# EAGLE design LEDARRAYHI (EAGLE 8.6.0)
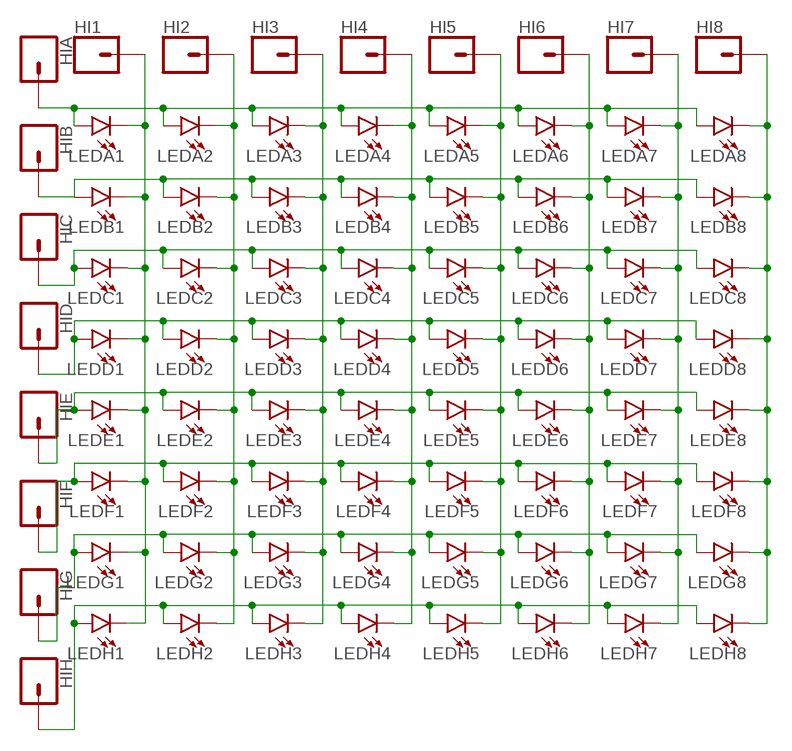
[diagram p0: schematic, sheet 1]

## Parts
HI1  CONN_01PTH_NO_SILK_KIT  [1X01NS_KIT]
HI2  CONN_01PTH_NO_SILK_KIT  [1X01NS_KIT]
HI3  CONN_01PTH_NO_SILK_KIT  [1X01NS_KIT]
HI4  CONN_01PTH_NO_SILK_KIT  [1X01NS_KIT]
HI5  CONN_01PTH_NO_SILK_KIT  [1X01NS_KIT]
HI6  CONN_01PTH_NO_SILK_KIT  [1X01NS_KIT]
HI7  CONN_01PTH_NO_SILK_KIT  [1X01NS_KIT]
HI8  CONN_01PTH_NO_SILK_KIT  [1X01NS_KIT]
HIA  CONN_01PTH_NO_SILK_KIT  [1X01NS_KIT]
HIB  CONN_01PTH_NO_SILK_KIT  [1X01NS_KIT]
HIC  CONN_01PTH_NO_SILK_KIT  [1X01NS_KIT]
HID  CONN_01PTH_NO_SILK_KIT  [1X01NS_KIT]
HIE  CONN_01PTH_NO_SILK_KIT  [1X01NS_KIT]
HIF  CONN_01PTH_NO_SILK_KIT  [1X01NS_KIT]
HIG  CONN_01PTH_NO_SILK_KIT  [1X01NS_KIT]
HIH  CONN_01PTH_NO_SILK_KIT  [1X01NS_KIT]
LEDA1  LED3MM  [LED_3MM]
LEDA2  LED3MM  [LED_3MM]
LEDA3  LED3MM  [LED_3MM]
LEDA4  LED3MM  [LED_3MM]
LEDA5  LED3MM  [LED_3MM]
LEDA6  LED3MM  [LED_3MM]
LEDA7  LED3MM  [LED_3MM]
LEDA8  LED3MM  [LED_3MM]
LEDB1  LED3MM  [LED_3MM]
LEDB2  LED3MM  [LED_3MM]
LEDB3  LED3MM  [LED_3MM]
LEDB4  LED3MM  [LED_3MM]
LEDB5  LED3MM  [LED_3MM]
LEDB6  LED3MM  [LED_3MM]
LEDB7  LED3MM  [LED_3MM]
LEDB8  LED3MM  [LED_3MM]
LEDC1  LED3MM  [LED_3MM]
LEDC2  LED3MM  [LED_3MM]
LEDC3  LED3MM  [LED_3MM]
LEDC4  LED3MM  [LED_3MM]
LEDC5  LED3MM  [LED_3MM]
LEDC6  LED3MM  [LED_3MM]
LEDC7  LED3MM  [LED_3MM]
LEDC8  LED3MM  [LED_3MM]
LEDD1  LED3MM  [LED_3MM]
LEDD2  LED3MM  [LED_3MM]
LEDD3  LED3MM  [LED_3MM]
LEDD4  LED3MM  [LED_3MM]
LEDD5  LED3MM  [LED_3MM]
LEDD6  LED3MM  [LED_3MM]
LEDD7  LED3MM  [LED_3MM]
LEDD8  LED3MM  [LED_3MM]
LEDE1  LED3MM  [LED_3MM]
LEDE2  LED3MM  [LED_3MM]
LEDE3  LED3MM  [LED_3MM]
LEDE4  LED3MM  [LED_3MM]
LEDE5  LED3MM  [LED_3MM]
LEDE6  LED3MM  [LED_3MM]
LEDE7  LED3MM  [LED_3MM]
LEDE8  LED3MM  [LED_3MM]
LEDF1  LED3MM  [LED_3MM]
LEDF2  LED3MM  [LED_3MM]
LEDF3  LED3MM  [LED_3MM]
LEDF4  LED3MM  [LED_3MM]
LEDF5  LED3MM  [LED_3MM]
LEDF6  LED3MM  [LED_3MM]
LEDF7  LED3MM  [LED_3MM]
LEDF8  LED3MM  [LED_3MM]
LEDG1  LED3MM  [LED_3MM]
LEDG2  LED3MM  [LED_3MM]
LEDG3  LED3MM  [LED_3MM]
LEDG4  LED3MM  [LED_3MM]
LEDG5  LED3MM  [LED_3MM]
LEDG6  LED3MM  [LED_3MM]
LEDG7  LED3MM  [LED_3MM]
LEDG8  LED3MM  [LED_3MM]
LEDH1  LED3MM  [LED_3MM]
LEDH2  LED3MM  [LED_3MM]
LEDH3  LED3MM  [LED_3MM]
LEDH4  LED3MM  [LED_3MM]
LEDH5  LED3MM  [LED_3MM]
LEDH6  LED3MM  [LED_3MM]
LEDH7  LED3MM  [LED_3MM]
LEDH8  LED3MM  [LED_3MM]

## Nets
N$2: HIG.1 LEDG1.A LEDG2.A LEDG3.A LEDG4.A LEDG5.A LEDG6.A LEDG7.A LEDG8.A
N$3: HIF.1 LEDF1.A LEDF2.A LEDF3.A LEDF4.A LEDF5.A LEDF6.A LEDF7.A LEDF8.A
N$4: HIH.1 LEDH1.A LEDH2.A LEDH3.A LEDH4.A LEDH5.A LEDH6.A LEDH7.A LEDH8.A
N$5: HID.1 LEDD1.A LEDD2.A LEDD3.A LEDD4.A LEDD5.A LEDD6.A LEDD7.A LEDD8.A
N$12: HIB.1 LEDB1.A LEDB2.A LEDB3.A LEDB4.A LEDB5.A LEDB6.A LEDB7.A LEDB8.A
N$15: HIE.1 LEDE1.A LEDE2.A LEDE3.A LEDE4.A LEDE5.A LEDE6.A LEDE7.A LEDE8.A
N$21: HIC.1 LEDC1.A LEDC2.A LEDC3.A LEDC4.A LEDC5.A LEDC6.A LEDC7.A LEDC8.A
N$32: HIA.1 LEDA1.A LEDA2.A LEDA3.A LEDA4.A LEDA5.A LEDA6.A LEDA7.A LEDA8.A
N$38: HI1.1 LEDA1.K(C) LEDB1.K(C) LEDC1.K(C) LEDD1.K(C) LEDE1.K(C) LEDF1.K(C) LEDG1.K(C) LEDH1.K(C)
N$39: HI2.1 LEDA2.K(C) LEDB2.K(C) LEDC2.K(C) LEDD2.K(C) LEDE2.K(C) LEDF2.K(C) LEDG2.K(C) LEDH2.K(C)
N$40: HI3.1 LEDA3.K(C) LEDB3.K(C) LEDC3.K(C) LEDD3.K(C) LEDE3.K(C) LEDF3.K(C) LEDG3.K(C) LEDH3.K(C)
N$41: HI4.1 LEDA4.K(C) LEDB4.K(C) LEDC4.K(C) LEDD4.K(C) LEDE4.K(C) LEDF4.K(C) LEDG4.K(C) LEDH4.K(C)
N$42: HI5.1 LEDA5.K(C) LEDB5.K(C) LEDC5.K(C) LEDD5.K(C) LEDE5.K(C) LEDF5.K(C) LEDG5.K(C) LEDH5.K(C)
N$43: HI6.1 LEDA6.K(C) LEDB6.K(C) LEDC6.K(C) LEDD6.K(C) LEDE6.K(C) LEDF6.K(C) LEDG6.K(C) LEDH6.K(C)
N$44: HI7.1 LEDA7.K(C) LEDB7.K(C) LEDC7.K(C) LEDD7.K(C) LEDE7.K(C) LEDF7.K(C) LEDG7.K(C) LEDH7.K(C)
N$45: HI8.1 LEDA8.K(C) LEDB8.K(C) LEDC8.K(C) LEDD8.K(C) LEDE8.K(C) LEDF8.K(C) LEDG8.K(C) LEDH8.K(C)

## Library data of the parts
HI1-HI8 HIA HIB HIC HID HIE HIF HIG HIH = SparkFun-Connectors:CONN_01: Single connection point. Often used as Generic Header-pin footprint for 0.1 inch spaced/style header connections On any of the 0.1 inch spaced packages, you can populate with these: Break Away Headers - Straight <https://www.sparkfun.com/products/116> (PRT-00116) Break Away Male Headers - Right Angle <https://www.sparkfun.com/products/553> (PRT-00553) Female Headers <https://www.sparkfun.com/products/115> (PRT-00115) Break Away Headers - Machine Pin <https://www.sparkfun.com/products/117> (PRT-00117) Break Away Female Headers - Swiss Machine Pin <https://www.sparkfun.com/products/743> (PRT-00743) This device is also useful as a general connection point to wire up your design to another part of your project. Our various solder wires solder well into these plated through hole pads. Hook-Up Wire - Assortment (Stranded, 22 AWG) <https://www.sparkfun.com/products/11375> (PRT-11375) Hook-Up Wire - Assortment (Solid Core, 22 AWG) <https://www.sparkfun.com/products/11367> (PRT-11367) View the entire wire category on our website here <https://www.sparkfun.com/categories/141> Special notes: SMTSO-256-ET is a "flush mount" nut for a 4-40 screw. We mostly use this on specialty testbeds; it is a nice way to connect hardware to your PCB at an adjustable hieght. Also note, the SNAP packages are for using a snappable style connector. We sell a baggie of snaps and they are also used on two LilyPad designs: Snap Assortment - 30 pack (male and female) <https://www.sparkfun.com/products/11347> (DEV-11347) LilyPad Arduino SimpleSnap <https://www.sparkfun.com/products/10941> (DEV-10941) LilyPad SimpleSnap Protoboard <https://www.sparkfun.com/products/10940> (DEV-10940)
LEDA1-LEDA8 LEDB1-LEDB8 LEDC1-LEDC8 LEDD1-LEDD8 LEDE1-LEDE8 LEDF1-LEDF8 LEDG1-LEDG8 LEDH1-LEDH8 = SparkFun-LED:LED: LED (Generic) Standard schematic elements and footprints for 5mm, 3mm, 1206, and 0603 sized LEDs. Generic LEDs with no color specified.; PROD_ID: DIO-08794

## Board
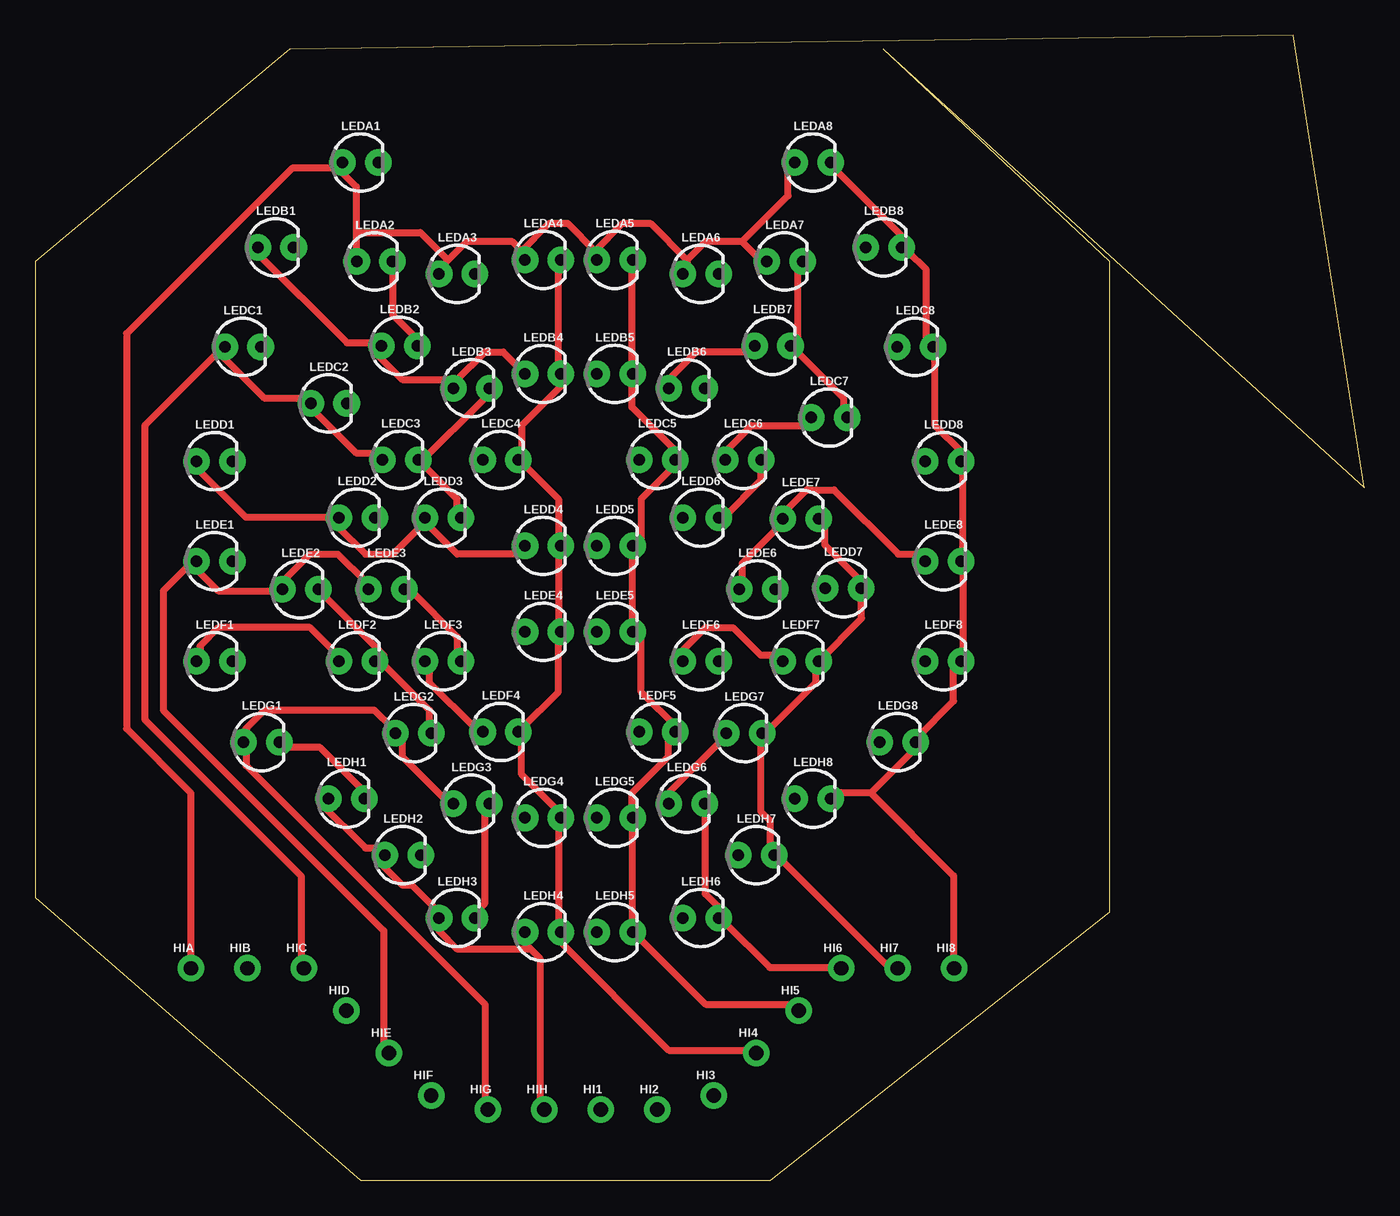
[diagram p1: board, top side]
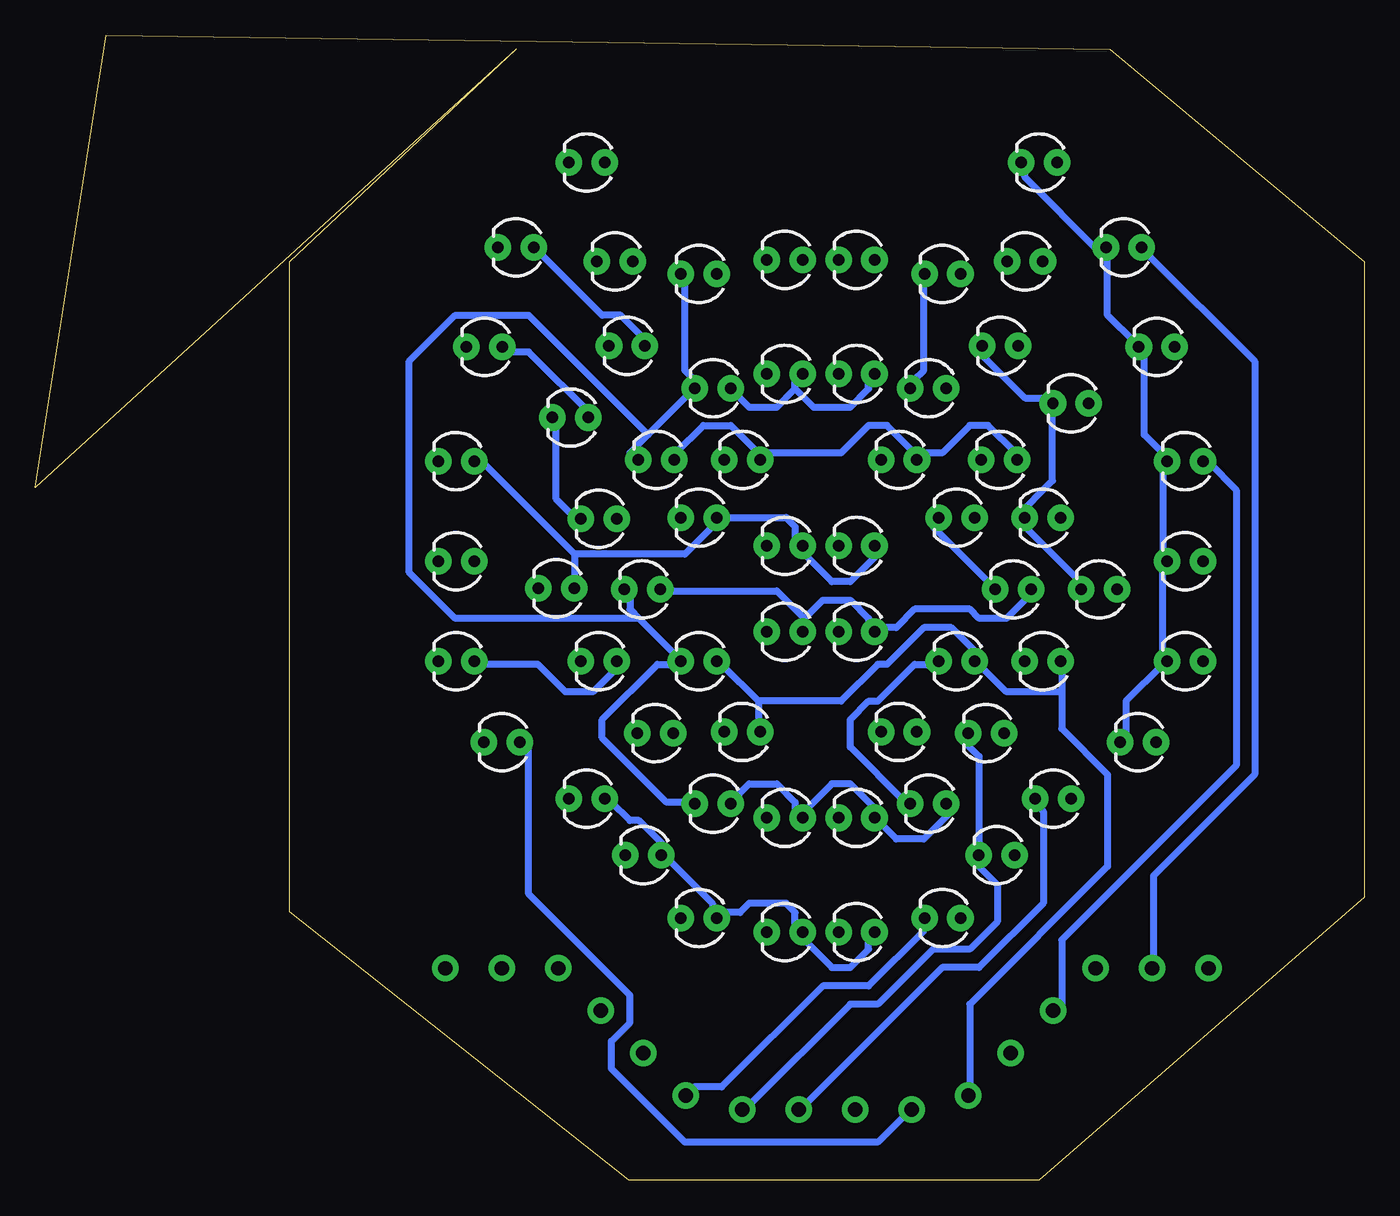
[diagram p2: board, bottom side, seen from below]

Size 94 x 81 mm. Coordinates in mm from the lower left corner, seen from the top.
Outline: 23,0 52,0 76,19 76,65 60,80 94,49 89,81 18,80 0,65 0,20 23,0
Copper layers (1*16): Top 0.035mm / dielectric 1.5mm / Bottom 0.035mm
Design rules "default *": minimum track width 0.5mm, minimum drill 0.5mm, track to track 0.8mm, track to pad 0.8mm, pad to pad 0.6mm, via to via 2mm, smd to smd 1mm, copper to edge 40mil, drill to drill 6mil, minimum pad ring 10mil, minimum via ring 8mil, stop-mask expansion 4mil, vias tented up to drill 0mil, thermal gap 10mil

### Footprints (pad centres in the part's own frame; a part is rotated, then mirrored left to right if it is on the bottom)
1X01NS_KIT = drill 1.016 pad 1.88: 1 0,0
LED_3MM = drill 0.813 pad 1.88: A -1.27,0; K 1.27,0

### Placement (x,y rotation side)
HI1  40,5 0 top
HI2  44,5 0 top
HI3  48,6 0 top
HI4  51,9 0 top
HI5  54,12 0 top
HI6  57,15 0 top
HI7  61,15 0 top
HI8  65,15 0 top
HIA  11,15 0 top
HIB  15,15 0 top
HIC  19,15 0 top
HID  22,12 0 top
HIE  25,9 0 top
HIF  28,6 0 top
HIG  32,5 0 top
HIH  36,5 0 top
LEDA1  23,72 0 top
LEDA2  24,65 0 top
LEDA3  29.83,64.12 0 top
LEDA4  35.91,65.12 0 top
LEDA5  40.99,65.12 0 top
LEDA6  47.07,64.12 0 top
LEDA7  53,65 0 top
LEDA8  55,72 0 top
LEDB1  17,66 0 top
LEDB2  25.75,59.04 0 top
LEDB3  30.83,56.04 0 top
LEDB4  35.91,57.04 0 top
LEDB5  40.99,57.04 0 top
LEDB6  46.07,56.04 0 top
LEDB7  52.15,59.04 0 top
LEDB8  60,66 0 top
LEDC1  14.67,58.96 0 top
LEDC2  20.75,54.96 0 top
LEDC3  25.83,50.96 0 top
LEDC4  32.91,50.96 0 top
LEDC5  43.99,50.96 0 top
LEDC6  50.07,50.96 0 top
LEDC7  56.15,53.96 0 top
LEDC8  62.23,58.96 0 top
LEDD1  12.67,50.88 0 top
LEDD2  22.75,46.88 0 top
LEDD3  28.83,46.88 0 top
LEDD4  35.91,44.88 0 top
LEDD5  40.99,44.88 0 top
LEDD6  47.07,46.88 0 top
LEDD7  57.15,41.88 0 top
LEDD8  64.23,50.88 0 top
LEDE1  12.67,43.8 0 top
LEDE2  18.75,41.8 0 top
LEDE3  24.83,41.8 0 top
LEDE4  35.91,38.8 0 top
LEDE5  40.99,38.8 0 top
LEDE6  51.07,41.8 0 top
LEDE7  54.15,46.8 0 top
LEDE8  64.23,43.8 0 top
LEDF1  12.67,36.72 0 top
LEDF2  22.75,36.72 0 top
LEDF3  28.83,36.72 0 top
LEDF4  32.91,31.72 0 top
LEDF5  43.99,31.72 0 top
LEDF6  47.07,36.72 0 top
LEDF7  54.15,36.72 0 top
LEDF8  64.23,36.72 0 top
LEDG1  16,31 0 top
LEDG2  26.75,31.64 0 top
LEDG3  30.83,26.64 0 top
LEDG4  35.91,25.64 0 top
LEDG5  40.99,25.64 0 top
LEDG6  46.07,26.64 0 top
LEDG7  50.15,31.64 0 top
LEDG8  61,31 0 top
LEDH1  22,27 0 top
LEDH2  26,23 0 top
LEDH3  29.83,18.56 0 top
LEDH4  35.91,17.56 0 top
LEDH5  40.99,17.56 0 top
LEDH6  47.07,18.56 0 top
LEDH7  51,23 0 top
LEDH8  55,27 0 top

### Tracks (layer width: path | path; a pad name or v marks a point on that pad's centre or on a via)
N$2
  Top 0.5: LEDG6.A 44.8,27.4 48.7,31.3 LEDG7.A | LEDG3.A 29.2,26.75 25.95,30 25.95,31.3 LEDG2.A 25.3,31.95 24,33.25 16.2,33.25 14.9,31.95 14.9,31.3 LEDG1.A 14.9,30.65 14.9,29.35 31.8,12.45 31.8,5.3 HIG.1
  Bottom 0.5: LEDG6.A 44.8,26.75 43.5,28.05 41.55,28.05 40.25,26.75 40.25,26.1 LEDG5.A 39.6,26.1 37.65,28.05 36.35,28.05 34.4,26.1 LEDG4.A 34.4,25.45 33.1,24.15 31.15,24.15 29.2,26.1 LEDG3.A | LEDG8.A 59.1,30.65 59.1,20.25 51.95,13.1 51.95,11.15 53.25,9.85 53.25,7.9 48.05,2.7 34.4,2.7 32.45,4.65 HIG.1
N$3
  Top 0.5: LEDF7.A 52.6,37.15 51.3,37.15 49.35,39.1 47.4,39.1 45.45,37.15 LEDF6.A | LEDF3.A 27.9,36.5 27.9,35.2 31.15,31.95 LEDF4.A | LEDF1.A 11.65,37.15 11.65,37.8 12.95,39.1 19.45,39.1 21.4,37.15 LEDF2.A
  Bottom 0.5: 42.85,33.9 42.85,31.95 LEDF5.A | 42.85,33.9 45.45,36.5 LEDF6.A | LEDF8.A 62.35,36.5 58.45,36.5 56.5,34.55 54.55,34.55 52.6,36.5 LEDF7.A | 21.4,34.55 21.4,36.5 LEDF2.A | 21.4,34.55 21.4,31.95 18.15,28.7 18.15,22.2 27.9,12.45 27.9,6.6 HIF.1 | 21.4,34.55 25.3,34.55 27.25,36.5 LEDF3.A 27.25,37.15 29.2,39.1 31.15,39.1 33.75,36.5 34.4,36.5 37,33.9 42.85,33.9
N$4
  Top 0.5: LEDH1.A 20.1,26.75 23.35,23.5 24.65,23.5 LEDH2.A 24.65,22.85 24.65,22.2 25.95,20.9 26.6,20.9 28.55,18.95 LEDH3.A 28.55,18.3 28.55,17.65 29.85,16.35 35.05,16.35 | 35.05,16.35 34.4,17 LEDH4.A | 35.05,16.35 35.7,15.7 35.7,5.3 HIH.1
  Bottom 0.5: LEDH8.A 53.25,26.75 51.95,25.45 51.3,25.45 49.35,23.5 LEDH7.A 49.35,22.85 46.1,19.6 46.1,18.95 LEDH6.A 45.45,18.95 44.15,18.95 43.5,19.6 40.9,19.6 40.25,18.95 40.25,17.65 LEDH5.A 39.6,17 37.65,15.05 36.35,15.05 35.05,16.35 35.05,17 LEDH4.A
N$5
  Top 0.5: LEDD4.A 34.4,44.3 29.85,44.3 27.9,46.25 LEDD3.A 27.25,46.25 25.3,44.3 23.35,44.3 21.4,46.25 LEDD2.A 21.4,46.9 14.9,46.9 11.65,50.15 11.65,50.8 LEDD1.A
  Bottom 0.5: 55.85,44.3 55.85,42.35 LEDD7.A | 55.85,44.3 62.35,50.8 LEDD8.A | LEDD4.A 34.4,44.3 36.35,42.35 37.65,42.35 39.6,44.3 LEDD5.A 40.25,44.95 40.25,46.25 40.9,46.9 45.45,46.9 LEDD6.A 46.1,46.25 48.05,44.3 55.85,44.3 | HID.1 21.4,12.45 21.4,17 9.05,29.35 9.05,48.85 11,50.8 LEDD1.A
N$12
  Top 0.5: LEDB4.A 34.4,57.3 33.1,58.6 31.8,58.6 29.85,56.65 LEDB3.A 29.2,56.65 25.95,56.65 24,58.6 LEDB2.A 24,59.25 22.05,59.25 15.55,65.75 LEDB1.A | LEDB6.A 44.8,56.65 46.75,58.6 50.65,58.6 LEDB7.A
  Bottom 0.5: 40.25,56 40.25,56.65 LEDB5.A | 40.25,56 41.55,54.7 43.5,54.7 44.8,56 LEDB6.A | LEDB8.A 58.45,65.75 53.9,61.2 52.6,61.2 50.65,59.25 LEDB7.A | 40.25,56 38.95,54.7 36.35,54.7 35.05,56 35.05,56.65 LEDB4.A | HIB.1 14.9,15.05 14.9,21.55 7.75,28.7 7.75,57.95 15.55,65.75 LEDB1.A
N$15
  Top 0.5: LEDE6.A 50,42.35 50,43.65 52.6,46.25 LEDE7.A 52.6,46.9 54.55,48.85 56.5,48.85 61.05,44.3 62.35,44.3 LEDE8.A | 11,43.65 9.05,41.7 9.05,33.25 24.65,17.65 24.65,9.2 HIE.1 | 11,43.65 12.95,41.7 16.85,41.7 LEDE2.A 17.5,42.35 19.45,44.3 21.4,44.3 23.35,42.35 LEDE3.A | 11,43.65 LEDE1.A
  Bottom 0.5: 39.6,39.75 40.25,39.1 LEDE5.A | 39.6,39.75 38.3,41.05 36.35,41.05 35.05,39.75 35.05,39.1 LEDE4.A 34.4,39.1 33.1,39.1 31.8,40.4 27.9,40.4 27.25,39.75 25.3,39.75 23.35,41.7 LEDE3.A | 39.6,39.75 41.55,41.7 49.35,41.7 LEDE6.A
N$21
  Top 0.5: LEDC7.A 54.55,53.4 50.65,53.4 48.7,51.45 LEDC6.A | LEDC3.A 24,51.45 22.7,51.45 19.45,54.7 LEDC2.A 19.45,55.35 16.2,55.35 12.95,58.6 | 12.95,58.6 7.75,53.4 7.75,32.6 18.8,21.55 18.8,15.05 HIC.1 | 12.95,58.6 LEDC1.A
  Bottom 0.5: LEDC6.A 48.7,51.45 46.75,53.4 44.8,53.4 42.85,51.45 LEDC5.A 42.2,51.45 37,51.45 35.05,53.4 33.75,53.4 31.8,51.45 LEDC4.A 31.15,51.45 29.85,51.45 27.9,53.4 26.6,53.4 24.65,51.45 LEDC3.A | LEDC8.A 60.4,58.6 59.1,58.6 54.55,54.05 LEDC7.A
N$32
  Top 0.5: 46.1,65.1 46.1,64.45 LEDA6.A | 46.1,65.1 47.4,66.4 50,66.4 | 50,66.4 51.3,65.1 LEDA7.A | 50,66.4 53.25,69.65 53.25,71.6 LEDA8.A | 29.2,65.1 30.5,66.4 33.75,66.4 34.4,65.75 | 29.2,65.1 28.55,64.45 LEDA3.A | 39.6,65.75 37.65,67.7 36.35,67.7 34.4,65.75 | 34.4,65.75 LEDA4.A | HIA.1 11,27.4 6.45,31.95 6.45,59.9 18.15,71.6 21.4,71.6 | 22.7,67.05 22.7,70.3 21.4,71.6 | 22.7,67.05 22.7,65.1 LEDA2.A | 21.4,71.6 LEDA1.A | 29.2,65.1 27.25,67.05 22.7,67.05 | 46.1,65.1 43.5,67.7 41.55,67.7 39.6,65.75 | 39.6,65.75 LEDA5.A
N$38
  Top 0.5: LEDH1.K 23.35,27.4 20.1,30.65 17.5,30.65 LEDG1.K
  Bottom 0.5: LEDA1.K 24,71.6 24,70.95 18.8,65.75 LEDB1.K 18.15,65.75 18.15,61.2 16.2,59.25 LEDC1.K 15.55,58.6 15.55,52.75 14.25,51.45 LEDD1.K 14.25,50.8 14.25,44.3 LEDE1.K 14.25,43.65 14.25,37.15 LEDF1.K 14.25,36.5 16.85,33.9 16.85,31.3 LEDG1.K | HI1.1 39.6,5.3 29.85,15.05 27.25,15.05 22.7,19.6 22.7,26.1 23.35,26.75 LEDH1.K
N$39
  Top 0.5: LEDA2.K 25.3,64.45 25.3,61.2 27.25,59.25 LEDB2.K | LEDG2.K 27.9,31.95 27.9,33.25 24.65,36.5 LEDF2.K 24.65,37.15 20.1,41.7 LEDE2.K
  Bottom 0.5: LEDB2.K 27.25,58.6 24,55.35 22.05,55.35 LEDC2.K 22.05,54.7 22.05,49.5 24.65,46.9 LEDD2.K 24,46.25 20.1,42.35 LEDE2.K | LEDG2.K 28.55,31.3 27.25,30 27.25,23.5 LEDH2.K 27.9,22.85 25.95,20.9 25.95,18.3 27.9,16.35 30.5,16.35 34.4,12.45 36.35,12.45 43.5,5.3 HI2.1
N$40
  Top 0.5: LEDF3.K 29.85,37.15 29.85,38.45 26.6,41.7 LEDE3.K | 27.25,50.8 29.85,48.2 29.85,46.9 LEDD3.K | 27.25,50.8 31.8,55.35 31.8,56 LEDB3.K | 27.25,50.8 LEDC3.K | LEDG3.K 31.8,26.1 31.8,19.6 31.15,18.95 LEDH3.K
  Bottom 0.5: LEDA3.K 31.15,63.8 31.15,57.3 31.8,56.65 LEDB3.K | LEDE3.K 26.6,42.35 30.5,46.25 LEDD3.K | HI3.1 47.4,6.6 45.45,6.6 38.3,13.75 35.05,13.75 31.15,17.65 31.15,18.3 LEDH3.K | LEDF3.K 30.5,36.5 31.8,36.5 34.4,33.9 35.05,33.9 36.35,32.6 36.35,30.65 32.45,26.75 LEDG3.K
N$41
  Top 0.5: LEDA4.K 37,65.1 37,57.3 LEDB4.K 37.65,56.65 34.4,53.4 34.4,51.45 LEDC4.K 34.4,50.8 37,48.2 37,44.95 LEDD4.K 37,44.3 37,39.1 LEDE4.K 37,38.45 37,34.55 34.4,31.95 LEDF4.K 34.4,31.3 34.4,28.7 37,26.1 LEDG4.K 37,25.45 37,17.65 LEDH4.K 37,17 44.8,9.2 50.65,9.2 HI4.1
N$42
  Top 0.5: LEDA5.K 42.2,65.1 42.2,57.3 LEDB5.K 42.2,56.65 42.2,54.7 45.45,51.45 LEDC5.K 45.45,50.8 42.85,48.2 42.85,44.95 LEDD5.K 42.2,44.3 42.2,39.1 LEDE5.K 42.85,38.45 42.85,34.55 45.45,31.95 LEDF5.K 44.8,31.3 44.8,30 42.2,27.4 42.2,26.1 LEDG5.K 42.2,25.45 42.2,17.65 LEDH5.K 42.85,17 47.4,12.45 53.9,12.45 HI5.1
N$43
  Top 0.5: LEDD6.K 48.7,46.9 51.3,49.5 51.3,50.8 LEDC6.K | HI6.1 56.5,15.05 51.95,15.05 48.7,18.3 LEDH6.K 48.7,18.95 47.4,20.25 47.4,26.1 LEDG6.K
  Bottom 0.5: 50.65,52.75 51.95,51.45 LEDC6.K | 50.65,52.75 47.4,56 LEDB6.K 47.4,56.65 48.05,57.3 48.05,63.8 LEDA6.K | 51.3,39.75 51.95,40.4 51.95,41.7 LEDE6.K | 51.3,39.75 48.7,37.15 LEDF6.K 48.7,36.5 50,36.5 53.9,32.6 53.9,31.3 49.35,26.75 47.4,26.75 LEDG6.K | 50.65,52.75 59.1,61.2 64.3,61.2 67.55,57.95 67.55,43 64.3,39.75 51.3,39.75
N$44
  Top 0.5: LEDA7.K 53.9,64.45 53.9,59.25 LEDB7.K 53.9,58.6 57.15,55.35 57.15,54.05 LEDC7.K | LEDE7.K 55.85,46.25 55.85,44.95 58.45,42.35 LEDD7.K 58.45,41.7 58.45,39.75 LEDF7.K 55.2,36.5 55.2,35.2 51.95,31.95 LEDG7.K 51.3,31.3 51.3,26.1 51.95,25.45 51.95,23.5 LEDH7.K 52.6,22.85 60.4,15.05 HI7.1
  Bottom 0.5: LEDC7.K 57.15,53.4 57.15,48.2 55.85,46.9 LEDE7.K
N$45
  Top 0.5: LEDA8.K 56.5,71.6 61.7,66.4 LEDB8.K 61.7,65.75 63,64.45 63,59.25 LEDC8.K 63.65,58.6 63.65,53.4 65.6,51.45 LEDD8.K 65.6,50.8 65.6,44.3 LEDE8.K 65.6,43.65 65.6,37.15 LEDF8.K 64.95,36.5 64.95,33.9 62.35,31.3 LEDG8.K 62.35,30.65 59.1,27.4 | 59.1,27.4 56.5,27.4 LEDH8.K | 59.1,27.4 64.95,21.55 64.95,15.05 HI8.1